# EasyEDA Pro project 低功耗物联网水质监测节点.epro

# Schematic 模板
Assembly Variant: Basic; Board Name: 模板; Create Date: 2026-04-27; Page Name: P1; Project Name: 模板; Schematic Name: 模板; Update Date: 2026-04-27; BladeWidth: 10; Company: 嘉立创EDA; Page Size: A4; RegionStart: 1; ShowBorder: 1; TitleBlock: 1; TitleBlockPosition: 3; Version: V1.0; XRegionCount: 6; YRegionCount: 4
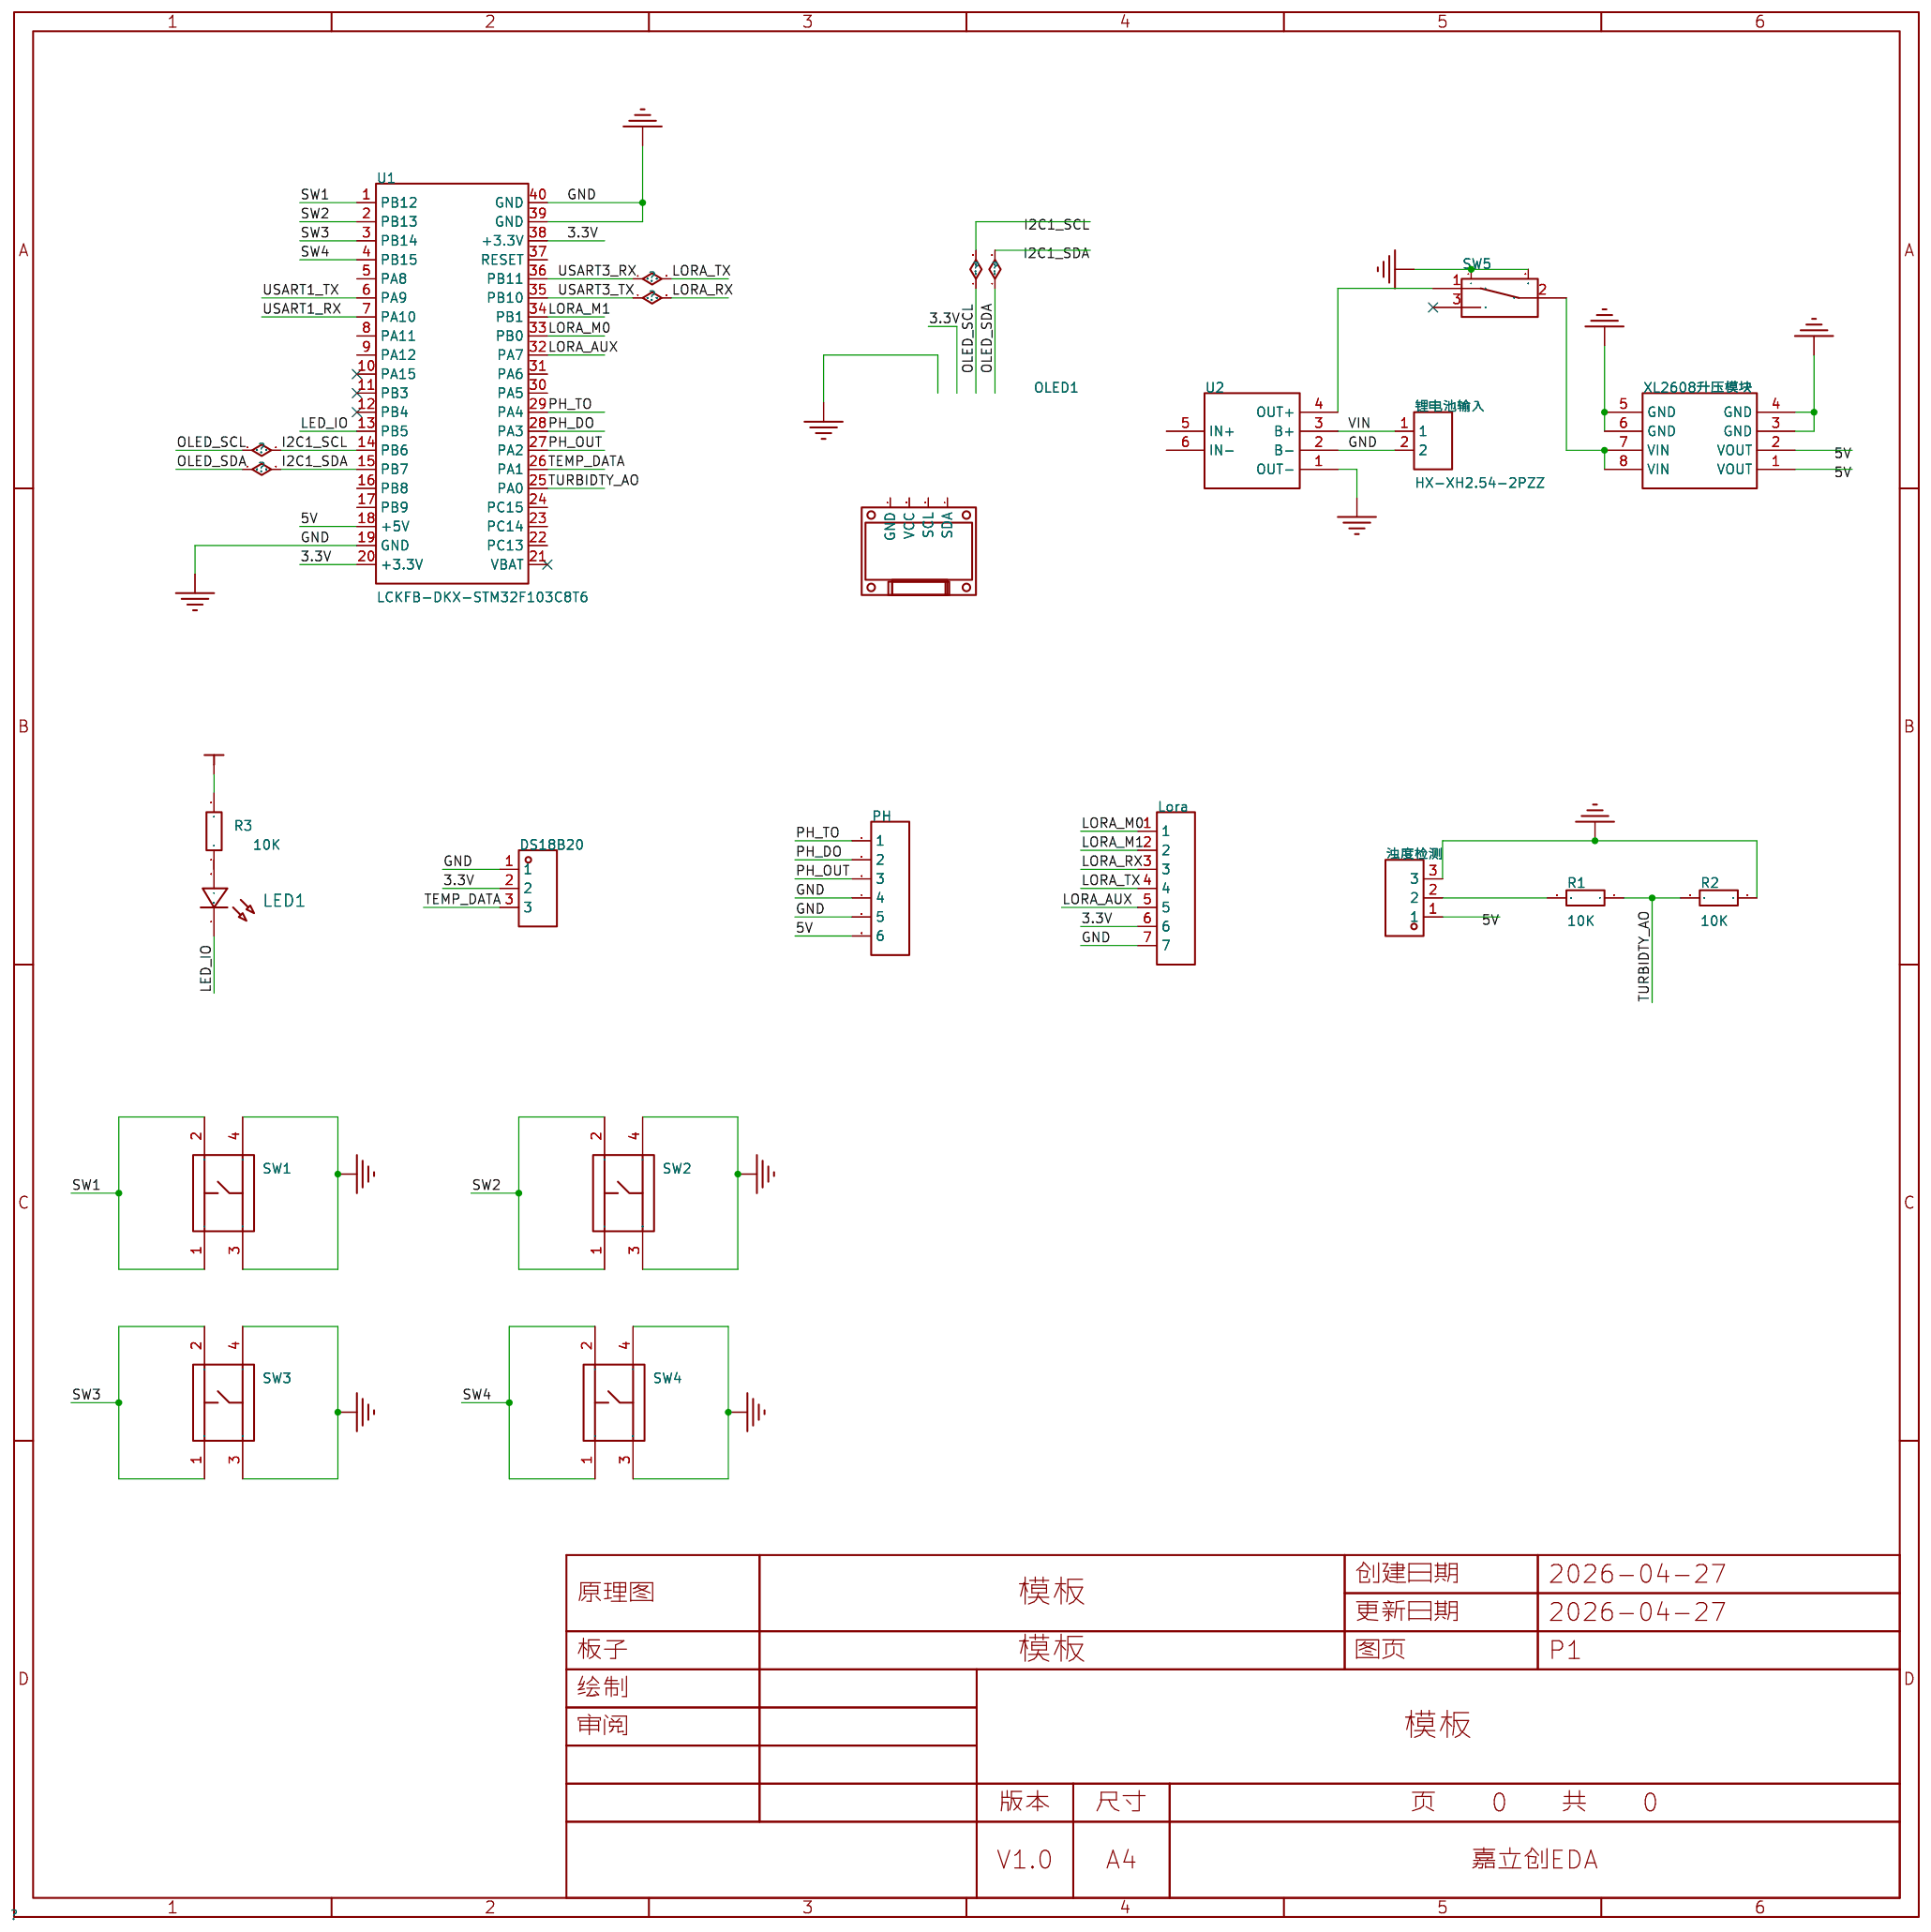
[diagram p0: schematic sheet]

## Parts
DS18B20  -  [HDR-TH_3P-P2.54-V-M]
LED1  -  [LED_0805]
Lora  -  [HDR-TH_7P-P2.54-V-M]
OLED1  -  [0.96OLED_4P]
PH  -  [HDR-TH_6P-P2.54-V-M-1]
R1  10K  [R0805]
R2  10K  [R0805]
R3  10K  [R0805]
SW1  K2-1102DP-C4SW-04  [KEY-TH_4P-L6.0-W6.0-P4.50-LS6.50]
SW2  K2-1102DP-C4SW-04  [KEY-TH_4P-L6.0-W6.0-P4.50-LS6.50]
SW3  K2-1102DP-C4SW-04  [KEY-TH_4P-L6.0-W6.0-P4.50-LS6.50]
SW4  K2-1102DP-C4SW-04  [KEY-TH_4P-L6.0-W6.0-P4.50-LS6.50]
SW5  SK-12D07-6  [拨动开关_侧]
U1  LCKFB-DKX-STM32F103C8T6  [CONN-TH_L53.3-W22.9_STM32F103C8T6-CARD]
U2  -  [TP4056 1A锂电池充电板模块]
XL2608升压模块  -  [XL3608升压模块]
浊度检测  -  [HDR-TH_3P-P2.54-V-M]
锂电池输入  HX-XH2.54-2PZZ  [CONN-TH_2P-P2.50_HX-2.54MM-2P-ZZ-MS]

## Library data of the parts
DS18B20 浊度检测 = HDR-M_2.54_1x3P: Supplier Part: C2937625; Supplier Footprint: 插件
LED1 = LED_0805-R: Supplier Footprint: 0805
Lora = HDR-M_2.54_1x7P: Supplier Part: C492406; Supplier Footprint: 插件
OLED1 = 0.96OLED模块_4P: Supplier Footprint: 插件
PH = HDR-M_2.54_1x6P: Supplier Part: C37208; Supplier Footprint: 插件
R1-R3 = Res_0805: Supplier Footprint: 0805
SW1-SW4 = K2-1102DP-C4SW-04: 电路结构:单刀单掷;按钮形状:圆形按钮;作用力:2.5N;安装方式:直插;开关长度:6mm;开关宽度:6mm;开关高度:5mm;触点电流:50mA;额定电压:12V;带灯:-;工作寿命:10万次;; LCSC Part Name: 轻触按键开关6*6*5; Supplier Part: C110153; Manufacturer: 韩国韩荣; Supplier Footprint: 插件-4P,6x6mm; JLCPCB Part Class: Extended Part; Datasheet: https://item.szlcsc.com/datasheet/K2-1102DP-C4SW-04/111374.html; Supplier: LCSC; Circuit: 单刀单掷; Actuator Style: 圆形按钮; Operating Force: 2.5N; Mounting Type: 直插; Length: 6mm; Width: 6mm; Switch Height: 5mm; Contact Current: 50mA; Voltage Rating: 12V; Life: 10万次; Operating Temperature: -25℃~+85℃
SW5 = SK-12D07-6: 安装方式:弯插;额定电流:300mA;额定电压:50V;工作寿命:1万次;; LCSC Part Name: 单排三脚 两档 侧插拨动开关 柄高6MM; Supplier Part: C5289941; Manufacturer: ROCPU Switches(台普); Supplier Footprint: 弯插,8.6x4.7mm; JLCPCB Part Class: Extended Part; Datasheet: https://item.szlcsc.com/datasheet/SK-12D07-6/6030151.html; Supplier: LCSC; Actuator Style: 矩形柱状; Termination Style: PC引脚; Length: 8.6mm; Width: 4.7mm; Switch Height: 9.5mm; Mounting Type: 弯插; Current Rating: 300mA; Voltage Rating: 50V; Life: 1万次
U1 = LCKFB-DKX-STM32F103C8T6: 搭载Contex M3内核,程序存储容量64KB,RAM总容量20KB,最高72MHz主频,提供高效的计算能力和稳定的运行环境。; LCSC Part Name: 立创·地阔星-STM32F103C8T6开发板; Supplier Part: C22396880; Manufacturer: 立创开发板; JLCPCB Part Class: Extended Part; Datasheet: https://item.szlcsc.com/datasheet/LCKFB-DKX-STM32F103C8T6/24005615.html; Supplier: LCSC
U2 = TP4056 1A锂电池充电板模块
XL2608升压模块 = XL2608升压模块
锂电池输入 = HX-XH2.54-2PZZ: 插针结构:1x2P;间距:2.54mm;安装方式:直插;参考系列:XH;总PIN数:2P;排数:1;每排PIN数:2;行距:-;额定电流:3A;触头材质:黄铜;触头镀层:锡;工作温度:-25℃~+85℃;; LCSC Part Name: 1x2P 间距:2.5mm 直插 系列:XH; Supplier Part: C42391660; Manufacturer: hanxia(韩下); Supplier Footprint: 插件,P=2.5mm; JLCPCB Part Class: Extended Part; Datasheet: https://item.szlcsc.com/datasheet/HX-XH2.54-2PZZ/44326932.html; Supplier: LCSC; Pins Structure: 1x2P; Pitch: 2.54mm; Mounting Type: 直插; Reference Series: XH; Number of Pins: 2P; Number of Rows: 1; Number of PINs Per Row: 2; Current Rating: 3A; Contact Material: 黄铜; Contact Plating: 锡; Operating Temperature: -25℃~+85℃; Voltage Rating: 250V; Plastic Material: PA66; Flame Retardant Rating: UL94V-0; Color: 白色

## Nets
3.3V: DS18B20.2 Lora.6 R3.2 U1.20(+3.3V) U1.38(+3.3V)
5V: PH.6 U1.18(+5V) XL2608升压模块.1(VOUT) XL2608升压模块.2(VOUT) 浊度检测.1
GND: DS18B20.1 Lora.7 PH.4 PH.5 R2.1 SW1.3 SW1.4 SW2.3 SW2.4 SW3.3 SW3.4 SW4.3 SW4.4 SW5.4 SW5.5 U1.19(GND) U1.39(GND) U1.40(GND) U2.1(OUT-) U2.2(B-) XL2608升压模块.3(GND) XL2608升压模块.4(GND) XL2608升压模块.5(GND) XL2608升压模块.6(GND) 浊度检测.3 锂电池输入.2
VIN: U2.3(B+) 锂电池输入.1
I2C1_SCL: U1.14(PB6)
I2C1_SDA: U1.15(PB7)
LED_IO: LED1.1(C) U1.13(PB5)
LORA_AUX: Lora.5 U1.32(PA7)
LORA_M0: Lora.1 U1.33(PB0)
LORA_M1: Lora.2 U1.34(PB1)
LORA_RX: Lora.3 U1.35(PB10)
LORA_TX: Lora.4 U1.36(PB11)
PH_DO: PH.2 U1.28(PA3)
PH_OUT: PH.3 U1.27(PA2)
PH_TO: PH.1 U1.29(PA4)
SW1: SW1.1 SW1.2 U1.1(PB12)
SW2: SW2.1 SW2.2 U1.2(PB13)
SW3: SW3.1 SW3.2 U1.3(PB14)
SW4: SW4.1 SW4.2 U1.4(PB15)
TEMP_DATA: DS18B20.3 U1.26(PA1)
TURBIDTY_AO: R1.1 R2.2 U1.25(PA0)
USART1_RX: U1.7(PA10)
USART1_TX: U1.6(PA9)
$1N59: LED1.2(A) R3.1
$1N78: SW5.2 XL2608升压模块.7(VIN) XL2608升压模块.8(VIN)
$1N99: SW5.1 U2.4(OUT+)
$1N140: R1.2 浊度检测.2

Not connected (* = marked no-connect by the designer): OLED1 1(GND) 2(VCC) 3(SCL) 4(SDA); SW5 3*; U1 5(PA8) 8(PA11) 9(PA12) 10(PA15)* 11(PB3)* 12(PB4)* 16(PB8) 17(PB9) 21(VBAT)* 22(PC13) 23(PC14) 24(PC15) 30(PA5) 31(PA6) 37(RESET); U2 5(IN+) 6(IN-)

# Board 模板
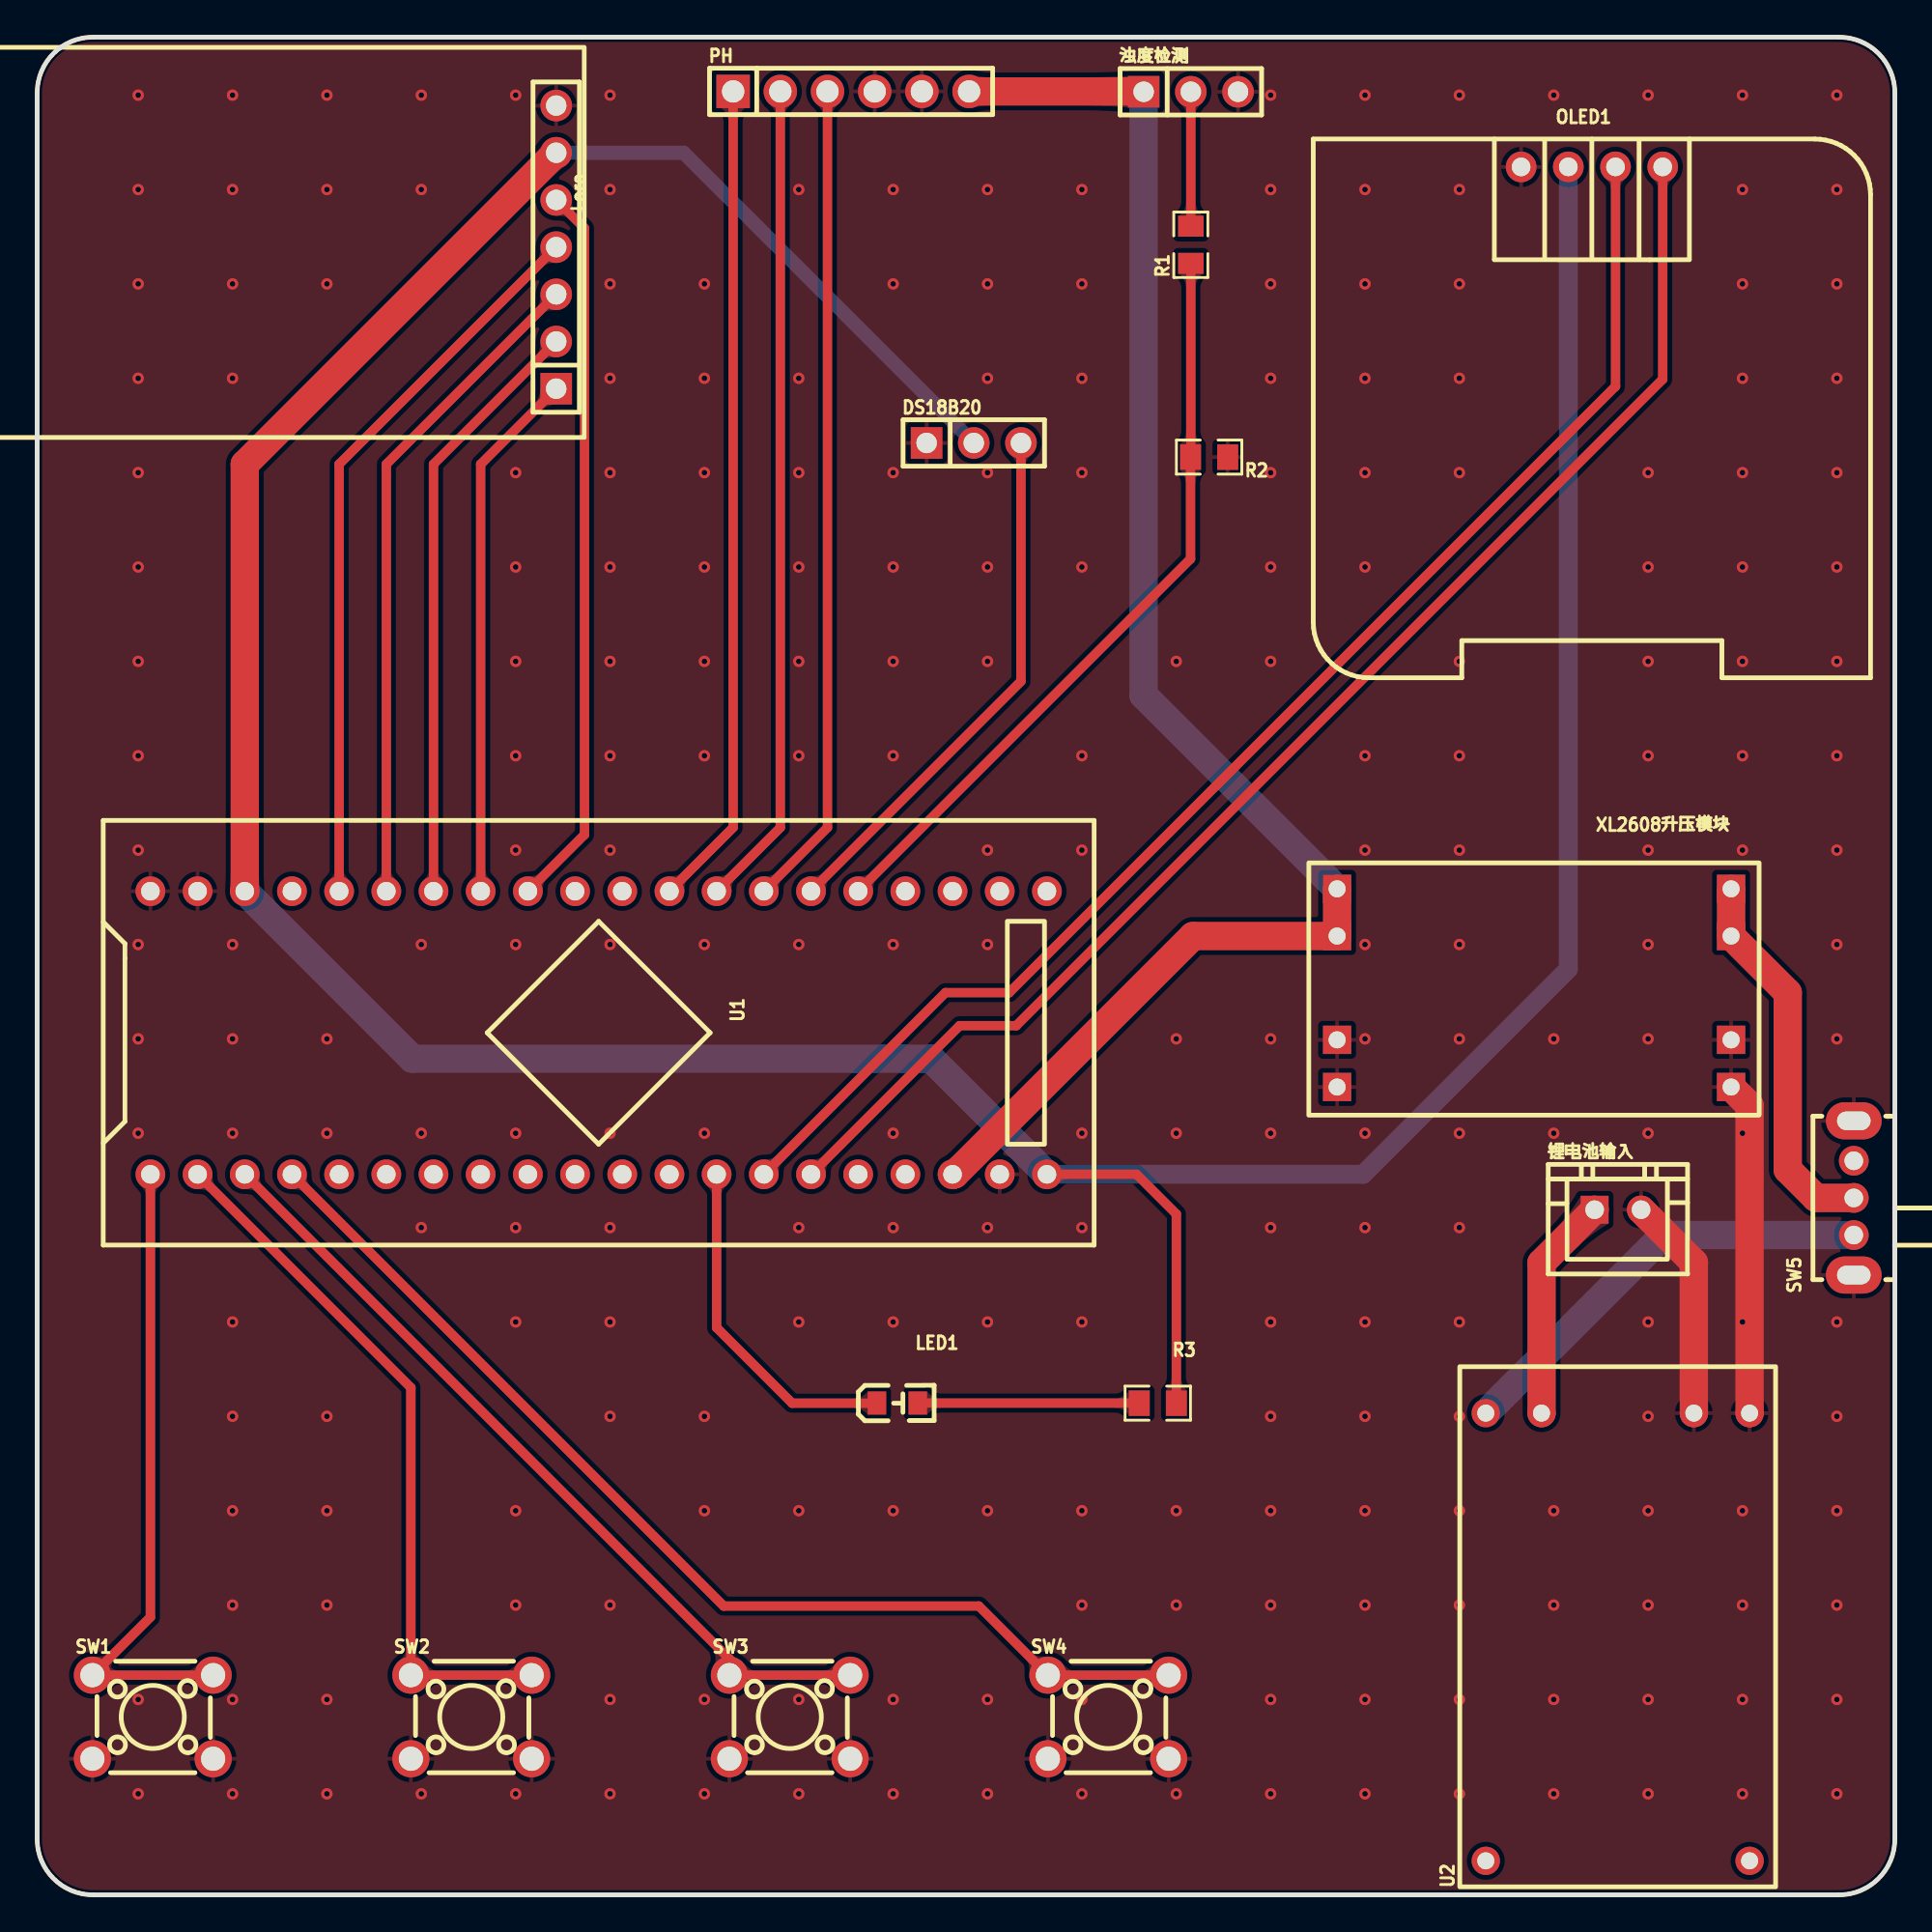
[diagram p1: board, top side]
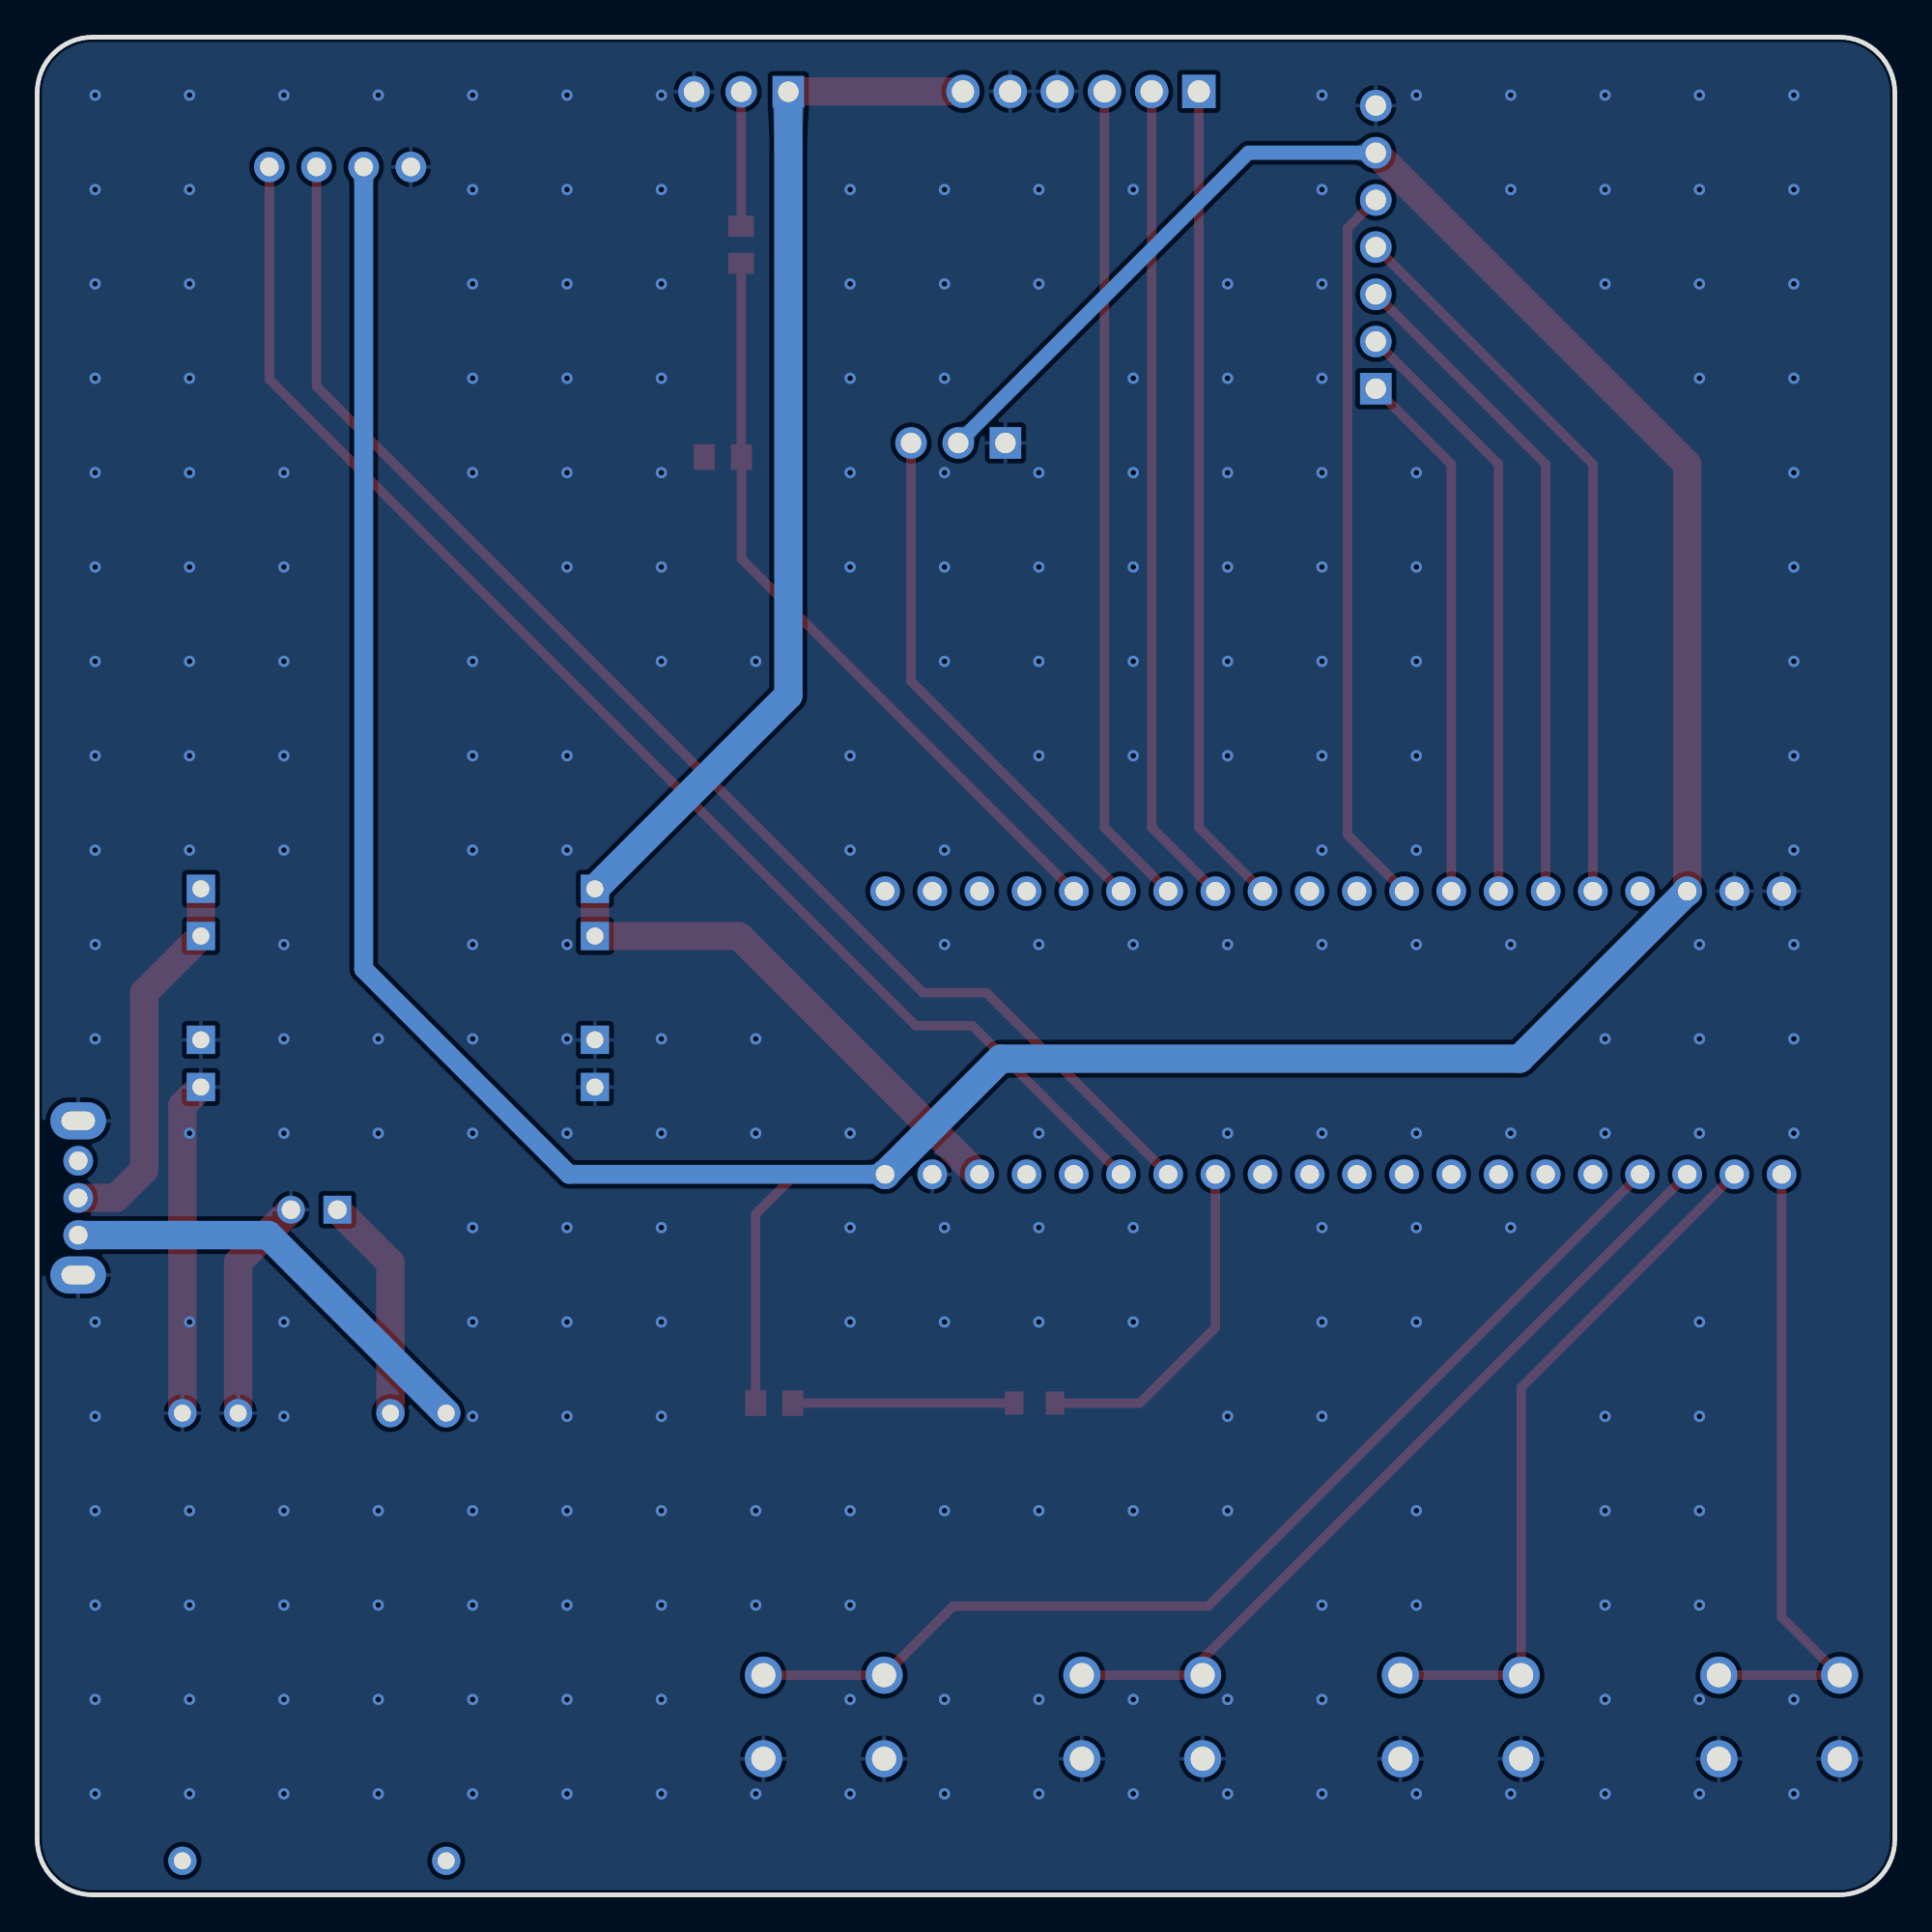
[diagram p2: board, bottom side, seen from below]

Outline 100 x 100 mm; copper layers: Top Layer, Bottom Layer. Coordinates in mm from the lower left corner of the outline.
Outline path: 0,97 0,3 arc(0.88,0.88) 3,0 97,0 arc(99.12,0.88) 100,3 100,97 arc(99.12,99.12) 97,100 3,100 arc(0.88,99.12) 0,97
Stack: Top Layer 0.035mm / Dielectric1 1.51mm FR4 er 4.5 / Bottom Layer 0.035mm

## Design rules (mm)
spacing copperThickness1oz (default): track to track 0.102, other pairs 0.152 to 0.3
spacing copperThickness2oz: track to track 0.203, other pairs 0.152 to 0.3
track width copperThickness1oz (default): min 0.127, default 0.254, max 2.54
track width copperThickness2oz: min 0.203, default 0.254, max 2.54
differential pair differentialPair (default): width min 0.127, default 0.254, max 2.54; gap min 0.152, default 0.152
net GND uses copperRegion

## Placement (name value [footprint] x y rotation side)
DS18B20  -  [HDR-TH_3P-P2.54-V-M]  50.42 78.16 0 top
LED1  -  [LED_0805]  46.35 26.47 0 top
Lora  -  [HDR-TH_7P-P2.54-V-M]  27.94 88.7 90 top
OLED1  -  [0.96OLED_4P]  83.69 93.02 0 top
PH  -  [HDR-TH_6P-P2.54-V-M-1]  43.81 97.08 0 top
R1  10K  [R0805]  62.1 88.82 90 top
R2  10K  [R0805]  63.09 77.39 180 top
R3  10K  [R0805]  60.32 26.47 0 top
SW1  K2-1102DP-C4SW-04  [KEY-TH_4P-L6.0-W6.0-P4.50-LS6.50]  6.22 9.58 0 top
SW2  K2-1102DP-C4SW-04  [KEY-TH_4P-L6.0-W6.0-P4.50-LS6.50]  23.37 9.58 0 top
SW3  K2-1102DP-C4SW-04  [KEY-TH_4P-L6.0-W6.0-P4.50-LS6.50]  40.51 9.58 0 top
SW4  K2-1102DP-C4SW-04  [KEY-TH_4P-L6.0-W6.0-P4.50-LS6.50]  57.66 9.58 0 top
SW5  SK-12D07-6  [拨动开关_侧]  97.79 37.52 90 top
U1  LCKFB-DKX-STM32F103C8T6  [CONN-TH_L53.3-W22.9_STM32F103C8T6-CARD]  30.23 46.41 0 top
U2  -  [TP4056 1A锂电池充电板模块]  76.58 0.43 90 top
XL2608升压模块  -  [XL3608升压模块]  68.45 55.55 0 top
浊度检测  -  [HDR-TH_3P-P2.54-V-M]  62.1 97.06 0 top
锂电池输入  HX-XH2.54-2PZZ  [CONN-TH_2P-P2.50_HX-2.54MM-2P-ZZ-MS]  85.09 36.88 0 top

## Footprints (pads in the part's own frame, mm; a bottom-side part is the same pattern mirrored in y, then rotated)
0.96OLED_4P
  round 1.65 hole 1: 1(-3.81,-0.002) 2(-1.27,0.002) 3(1.27,0.002) 4(3.81,0.002)
CONN-TH_2P-P2.50_HX-2.54MM-2P-ZZ-MS
  rect 1.5x1.5 hole 1: 1(-1.25,0)
  round 1.5 hole 1: 2(1.25,0)
CONN-TH_L53.3-W22.9_STM32F103C8T6-CARD
  round 1.6 hole 1: 1(-24.13,-7.62) 2(-21.59,-7.62) 3(-19.05,-7.62) 4(-16.51,-7.62) 5(-13.97,-7.62) 6(-11.43,-7.62) 7(-8.89,-7.62) 8(-6.35,-7.62) 9(-3.81,-7.62) 10(-1.27,-7.62) 11(1.27,-7.62) 12(3.81,-7.62) 13(6.35,-7.62) 14(8.89,-7.62) 15(11.43,-7.62) 16(13.97,-7.62) 17(16.51,-7.62) 18(19.05,-7.62) 19(21.59,-7.62) 20(24.13,-7.62) 21(24.13,7.62) 22(21.59,7.62) 23(19.05,7.62) 24(16.51,7.62) 25(13.97,7.62) 26(11.43,7.62) 27(8.89,7.62) 28(6.35,7.62) 29(3.81,7.62) 30(1.27,7.62) 31(-1.27,7.62) 32(-3.81,7.62) 33(-6.35,7.62) 34(-8.89,7.62) 35(-11.43,7.62) 36(-13.97,7.62) 37(-16.51,7.62) 38(-19.05,7.62) 39(-21.59,7.62) 40(-24.13,7.62)
HDR-TH_3P-P2.54-V-M
  rect 1.7x1.7 hole 1.1: 1(-2.54,0)
  round 1.7 hole 1.1: 2(0,0) 3(2.54,0)
HDR-TH_6P-P2.54-V-M-1
  rect 1.8x1.8 hole 1.2: 1(-6.35,0)
  round 1.8 hole 1.2: 2(-3.81,0) 3(-1.27,0) 4(1.27,0) 5(3.81,0) 6(6.35,0)
HDR-TH_7P-P2.54-V-M
  rect 1.7x1.7 hole 1.1: 1(-7.62,0)
  round 1.7 hole 1.1: 2(-5.08,0) 3(-2.54,0) 4(0,0) 5(2.54,0) 6(5.08,0) 7(7.62,0)
KEY-TH_4P-L6.0-W6.0-P4.50-LS6.50
  round 2 hole 1.3: 1(-3.25,2.25) 2(3.25,2.25) 3(-3.25,-2.25) 4(3.25,-2.25)
LED_0805
  rect 1x1.25 smd: 1(-1.15,0.005) 2(1.05,0.005)
R0805
  rect 1.133x1.377 smd: 1(-1,0) 2(1,0)
TP4056 1A锂电池充电板模块
  round 1.524 hole 0.914: 1(25.5,-15.6) 2(25.5,-12.6) 3(25.5,-4.4) 4(25.5,-1.4) 5(1.4,-1.4) 6(1.4,-15.601)
XL3608升压模块
  rect 1.524x1.524 hole 0.914: 1(1.524,-1.397) 2(1.524,-3.937) 3(1.524,-9.525) 4(1.524,-12.065) 5(22.733,-12.065) 6(22.733,-9.525) 7(22.733,-3.937) 8(22.733,-1.397)
拨动开关_侧
  oval 1.6x1.6 hole 1.001: 1(-1.999,0) 2(0,0) 3(1.999,0)
  oval 1.999x2.999 hole 1.001x1.801: 4(4.151,0) 5(-4.151,0)

## Nets
As in the schematic, except:
3.3V: DS18B20.2 Lora.6 OLED1.2 R3.2 U1.20 U1.38
GND: DS18B20.1 Lora.7 OLED1.1 PH.4 PH.5 R2.1 SW1.3 SW1.4 SW2.3 SW2.4 SW3.3 SW3.4 SW4.3 SW4.4 SW5.4 SW5.5 U1.19 U1.39 U1.40 U2.1 U2.2 XL2608升压模块.3 XL2608升压模块.4 XL2608升压模块.5 XL2608升压模块.6 浊度检测.3 锂电池输入.2
I2C1_SCL: OLED1.3 U1.14
I2C1_SDA: OLED1.4 U1.15

Pads without a net: SW5 3; U1 5 8 9 10 11 12 16 17 21 22 23 24 30 31 37; U2 5 6

## Via types
v1: diameter 0.61, hole 0.305, Top Layer to Bottom Layer, 249 vias

## Routing (per net, layer and track width the routed paths; a pad name or vN(x,y) marks a point on that pad's centre or on a via; arc(x,y) is an arc through that point)
3.3V: length 219
  Top Layer w0.508: U1.20 59.18,38.79 61.32,36.64 R3.2
  Top Layer w1.524: Lora.6 11.18,77.01 U1.38
  Bottom Layer w0.762: Lora.6 34.8,93.78 DS18B20.2
  Bottom Layer w1.016: OLED1.2 82.42,49.83 71.37,38.79 U1.20
  Bottom Layer w1.524: U1.20 48.13,45.01 20.19,45.01 U1.38
5V: length 85.2
  Top Layer w1.524: U1.18 49.39,38.79 62.22,51.61 XL2608升压模块.2 XL2608升压模块.1 ; PH.6 59.54,97.08 浊度检测.1
  Bottom Layer w1.524: XL2608升压模块.1 59.56,64.57 浊度检测.1
GND: length 30.1
  Top Layer w1.524: U2.1 92.18,42.49 XL2608升压模块.5 ; U2.2 89.18,34.04 锂电池输入.2
  vias: v1(5.44,96.88) v1(5.44,91.8) v1(5.44,86.72) v1(5.44,81.64) v1(5.44,76.56) v1(5.44,71.48) v1(5.44,66.4) v1(5.44,61.32) v1(5.44,56.24) v1(5.44,51.16) v1(5.44,46.08) v1(5.44,41) v1(5.44,10.52) v1(5.44,5.44) v1(10.52,96.88) v1(10.52,91.8) v1(10.52,86.72) v1(10.52,81.64) v1(10.52,51.16) v1(10.52,46.08) v1(10.52,41) v1(10.52,30.84) v1(10.52,25.76) v1(10.52,20.68) v1(10.52,15.6) v1(10.52,10.52) v1(10.52,5.44) v1(15.6,96.88) v1(15.6,91.8) v1(15.6,86.72) v1(15.6,46.08) v1(15.6,41) v1(15.6,25.76) v1(15.6,20.68) v1(15.6,15.6) v1(15.6,10.52) v1(15.6,5.44) v1(20.68,96.88) v1(20.68,91.8) v1(20.68,51.16) v1(20.68,41) v1(20.68,35.92) v1(20.68,5.44) v1(25.76,96.88) v1(25.76,76.56) v1(25.76,71.48) v1(25.76,66.4) v1(25.76,61.32) v1(25.76,56.24) v1(25.76,51.16) v1(25.76,41) v1(25.76,35.92) v1(25.76,30.84) v1(25.76,20.68) v1(25.76,15.6) v1(25.76,5.44) v1(30.84,96.88) v1(30.84,91.8) v1(30.84,86.72) v1(30.84,81.64) v1(30.84,76.56) v1(30.84,71.48) v1(30.84,66.4) v1(30.84,61.32) v1(30.84,56.24) v1(30.84,51.16) v1(30.84,41) v1(30.84,35.92) v1(30.84,30.84) v1(30.84,25.76) v1(30.84,15.6) v1(30.84,10.52) v1(30.84,5.44) v1(35.92,86.72) v1(35.92,81.64) v1(35.92,76.56) v1(35.92,71.48) v1(35.92,66.4) v1(35.92,61.32) v1(35.92,51.16) v1(35.92,41) v1(35.92,25.76) v1(35.92,20.68) v1(35.92,10.52) v1(35.92,5.44) v1(41,91.8) v1(41,81.64) v1(41,76.56) v1(41,71.48) v1(41,66.4) v1(41,61.32) v1(41,51.16) v1(41,35.92) v1(41,30.84) v1(41,20.68) v1(41,10.52) v1(41,5.44) v1(46.08,91.8) v1(46.08,86.72) v1(46.08,76.56) v1(46.08,71.48) v1(46.08,66.4) v1(46.08,61.32) v1(46.08,51.16) v1(46.08,41) v1(46.08,35.92) v1(46.08,30.84) v1(46.08,20.68) v1(46.08,10.52) v1(46.08,5.44) v1(51.16,91.8) v1(51.16,86.72) v1(51.16,81.64) v1(51.16,76.56) v1(51.16,71.48) v1(51.16,66.4) v1(51.16,56.24) v1(51.16,51.16) v1(51.16,35.92) v1(51.16,30.84) v1(51.16,20.68) v1(51.16,10.52) v1(51.16,5.44) v1(56.24,91.8) v1(56.24,86.72) v1(56.24,81.64) v1(56.24,76.56) v1(56.24,71.48) v1(56.24,61.32) v1(56.24,56.24) v1(56.24,41) v1(56.24,35.92) v1(56.24,30.84) v1(56.24,20.68) v1(56.24,15.6) v1(56.24,10.52) v1(56.24,5.44) v1(61.32,66.4) v1(61.32,46.08) v1(61.32,41) v1(61.32,20.68) v1(61.32,15.6) v1(61.32,5.44) v1(66.4,96.88) v1(66.4,91.8) v1(66.4,86.72) v1(66.4,81.64) v1(66.4,76.56) v1(66.4,71.48) v1(66.4,66.4) v1(66.4,46.08) v1(66.4,41) v1(66.4,35.92) v1(66.4,30.84) v1(66.4,25.76) v1(66.4,20.68) v1(66.4,15.6) v1(66.4,10.52) v1(66.4,5.44) v1(71.48,96.88) v1(71.48,91.8) v1(71.48,86.72) v1(71.48,81.64) v1(71.48,76.56) v1(71.48,71.48) v1(71.48,61.32) v1(71.48,56.24) v1(71.48,51.16) v1(71.48,46.08) v1(71.48,41) v1(71.48,35.92) v1(71.48,30.84) v1(71.48,25.76) v1(71.48,20.68) v1(71.48,15.6) v1(71.48,10.52) v1(71.48,5.44) v1(76.56,96.88) v1(76.56,91.8) v1(76.56,86.72) v1(76.56,81.64) v1(76.56,76.56) v1(76.56,66.4) v1(76.56,61.32) v1(76.56,56.24) v1(76.56,51.16) v1(76.56,46.08) v1(76.56,41) v1(76.56,35.92) v1(76.56,30.84) v1(76.56,25.76) v1(76.56,20.68) v1(76.56,15.6) v1(76.56,10.52) v1(76.56,5.44) v1(81.64,96.88) v1(81.64,46.08) v1(81.64,41) v1(81.64,20.68) v1(81.64,15.6) v1(81.64,10.52) v1(81.64,5.44) v1(86.72,96.88) v1(86.72,76.56) v1(86.72,71.48) v1(86.72,66.4) v1(86.72,61.32) v1(86.72,56.24) v1(86.72,51.16) v1(86.72,46.08) v1(86.72,41) v1(86.72,30.84) v1(86.72,25.76) v1(86.72,20.68) v1(86.72,15.6) v1(86.72,10.52) v1(86.72,5.44) v1(91.8,96.88) v1(91.8,91.8) v1(91.8,86.72) v1(91.8,81.64) v1(91.8,76.56) v1(91.8,71.48) v1(91.8,66.4) v1(91.8,61.32) v1(91.8,56.24) v1(91.8,41) v1(91.8,30.84) v1(91.8,20.68) v1(91.8,15.6) v1(91.8,10.52) v1(91.8,5.44) v1(96.88,96.88) v1(96.88,91.8) v1(96.88,86.72) v1(96.88,81.64) v1(96.88,76.56) v1(96.88,71.48) v1(96.88,66.4) v1(96.88,61.32) v1(96.88,56.24) v1(96.88,51.16) v1(96.88,46.08) v1(96.88,30.84) v1(96.88,25.76) v1(96.88,20.68) v1(96.88,15.6) v1(96.88,10.52) v1(96.88,5.44)
VIN: length 12.1
  Top Layer w1.524: U2.3 80.98,34.02 锂电池输入.1
I2C1_SCL: length 75.2
  Top Layer w0.508: U1.14 48.9,48.56 52.32,48.56 84.96,81.2 OLED1.3
I2C1_SDA: length 75
  Top Layer w0.508: U1.15 49.66,46.79 52.71,46.79 87.5,81.58 OLED1.4
LED_IO: length 18.6
  Top Layer w0.508: LED1.1 45.2,26.47 40.64,26.47 36.58,30.53 U1.13
LORA_AUX: length 39.1
  Top Layer w0.508: U1.32 29.46,57.07 29.46,89.71 27.94,91.24
LORA_M0: length 28.7
  Top Layer w0.508: Lora.1 23.88,77.01 U1.33
LORA_M1: length 32.3
  Top Layer w0.508: Lora.2 21.34,77.01 U1.34
LORA_RX: length 35.9
  Top Layer w0.508: U1.35 18.8,77.01 Lora.3
LORA_TX: length 39.5
  Top Layer w0.508: Lora.4 16.26,77.01 U1.36
PH_DO: length 44.5
  Top Layer w0.508: U1.28 40,57.45 PH.2
PH_OUT: length 44.5
  Top Layer w0.508: U1.27 42.54,57.45 PH.3
PH_TO: length 44.5
  Top Layer w0.508: U1.29 37.47,57.45 PH.1
SW1: length 34.8
  Top Layer w0.508: SW1.2 SW1.1 6.1,14.95 U1.1
SW2: length 38.2
  Top Layer w0.508: U1.2 20.12,27.3 SW2.1 SW2.2
SW3: length 44.3
  Top Layer w0.508: U1.3 37.26,12.7 SW3.1 SW3.2
SW4: length 58.4
  Top Layer w0.508: SW4.2 SW4.1 50.69,15.54 36.96,15.54 U1.4
TEMP_DATA: length 28.8
  Top Layer w0.508: U1.26 52.96,65.33 DS18B20.3
TURBIDTY_AO: length 41.2
  Top Layer w0.508: U1.25 62.09,71.92 R2.2 62.1,77.41 R1.1
$1N59: length 11.9
  Top Layer w0.508: R3.1 59.32,26.47 LED1.2
$1N78: length 20.6
  Top Layer w1.524: SW5.2 95.76,37.52 94.23,39.04 94.23,48.56 XL2608升压模块.7 XL2608升压模块.8
$1N99: length 23.8
  Bottom Layer w1.524: 97.79,35.52 87.57,35.52 U2.4
$1N140: length 7.2
  Top Layer w0.508: 浊度检测.2 R1.2

## Copper pours and planes (outline as drawn; the poured copper is in the pictures)
GND on Top Layer: -30.35,118.8 171.96,118.8 171.96,-40.59 -30.35,-40.59
GND on Bottom Layer: -12.95,105.33 121.92,105.33 121.92,-12.9 -12.95,-12.9

Small or netless copper shapes (teardrops, artwork), in the pictures only: 57 on Top Layer, 8 on Bottom Layer
